# Altium schematic sheet ISO_Power.SchDoc
size A4; SheetNumber: 3; SheetTotal: 3
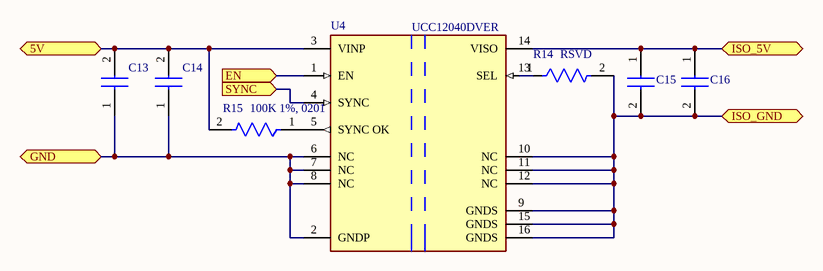
[diagram p0: ISO_Power.SchDoc]

## Parts
C13  10 uF, 25V, X6S, 0402  [CAPC1005X70N]  (value not drawn)
C14  100 nF, 25V, X6S, 0201  [CAPC0603X33N]  (value not drawn)
C15  100 nF, 25V, X6S, 0201  [CAPC0603X33N]  (value not drawn)
C16  10 uF, 25V, X6S, 0402  [CAPC1005X70N]  (value not drawn)
R14  RSVD  [FP-ERJ1GN-IPC_A]  (no BOM)
R15  100K 1%, 0201  [FP-ERJ1GN-IPC_A]
U4  UCC12040DVER  [FP-DVE0016A-MFG]

## Ports
5V (bidir, see MainShunt[1A]), EN (in, see MainShunt[1A]), GND (bidir, see MainShunt[1A]), ISO_5V (bidir, see MainShunt[1A]), ISO_GND (bidir, see MainShunt[1A]), SYNC (in, see MainShunt[1A])

## Nets
5V: C13.2 C14.2 R15.2 U4.3(VINP) ; port 5V
EN: U4.1(EN) ; port EN
GND: C13.1 C14.1 U4.2(GNDP) U4.6(NC) U4.7(NC) U4.8(NC) ; port GND
ISO_5V: C15.1 C16.1 U4.14(VISO) ; port ISO_5V
ISO_GND: C15.2 C16.2 R14.2 U4.9(GNDS) U4.10(NC) U4.11(NC) U4.12(NC) U4.15(GNDS) U4.16(GNDS) ; port ISO_GND
SYNC: U4.4(SYNC) ; port SYNC
NetR14_1: R14.1 U4.13(SEL)
NetR15_1: R15.1 U4.5(SYNC_OK)

## Library data of the parts
C13 C16 = GRM155F51E104ZA01E: Capacitor; Manufacturer_Name: Murata Electronics; Datasheet Link: http://www.murata.com/~/media/webrenewal/support/library/catalog/products/capacitor/mlcc/c02e.pdf; Height: 0.7mm; Manufacturer_Part_Number: GRM155F51E104ZA01E; Mouser Part Number: 81-GRM15F51E104ZA01E; Mouser Price/Stock: https://www.mouser.com/Search/Refine.aspx?Keyword=81-GRM15F51E104ZA01E
C14 C15 = GRM033C81E104KE14D: Capacitor; Manufacturer_Name: Murata Electronics; Datasheet Link: https://search.murata.co.jp/Ceramy/image/img/A01X/G101/ENG/GRM033C81E104KE14-01A.pdf; Height: 0.33mm; Manufacturer_Part_Number: GRM033C81E104KE14D; Mouser Part Number: 81-GRM33C81E104KE14D; Mouser Price/Stock: https://www.mouser.co.uk/ProductDetail/Murata-Electronics/GRM033C81E104KE14D?qs=P%2FC4Eoq9CDwxe7d5nXqGrA%3D%3D; Arrow Part Number: GRM033C81E104KE14D; Arrow Price/Stock: https://www.arrow.com/en/products/grm033c81e104ke14d/murata-manufacturing
R14 R15 = CMP-2004-03446-2: RES SMD 100K OHM 1% 1/20W 0201; Temperature Coefficient: 200ppm/°C; Voltage Rating: 25V; Max Power Dissipation: 50mW; Resistance: 100kR; Packaging: Tape and Reel; Tolerance: 1%; Mount: Surface Mount; Case Code (Metric): 0603; Number of Terminations: 2; Contact Plating: Tin; Case Code (Imperial): 0201; Width: 0.012inch; Lead Free: Lead Free; Radiation Hardening: No; Termination: SMD/SMT; Weight: 6E-06oz; Height: 0.01inch; Max Operating Temperature: 125°C; Number of Pins: 2; REACH SVHC: No SVHC; Power Rating: 50mW; Voltage Rating (DC): 25V; Package Quantity: 15000; Case/Package: 0201; Min Operating Temperature: -55°C; Length: 0.024inch; Composition: Thick Film
U4 = CMP-04910-000064-1: DC DC CONVERTER 3.3V 5V 500MW